# Altium project relay_matrix.PrjPCB (part 1 of 2)
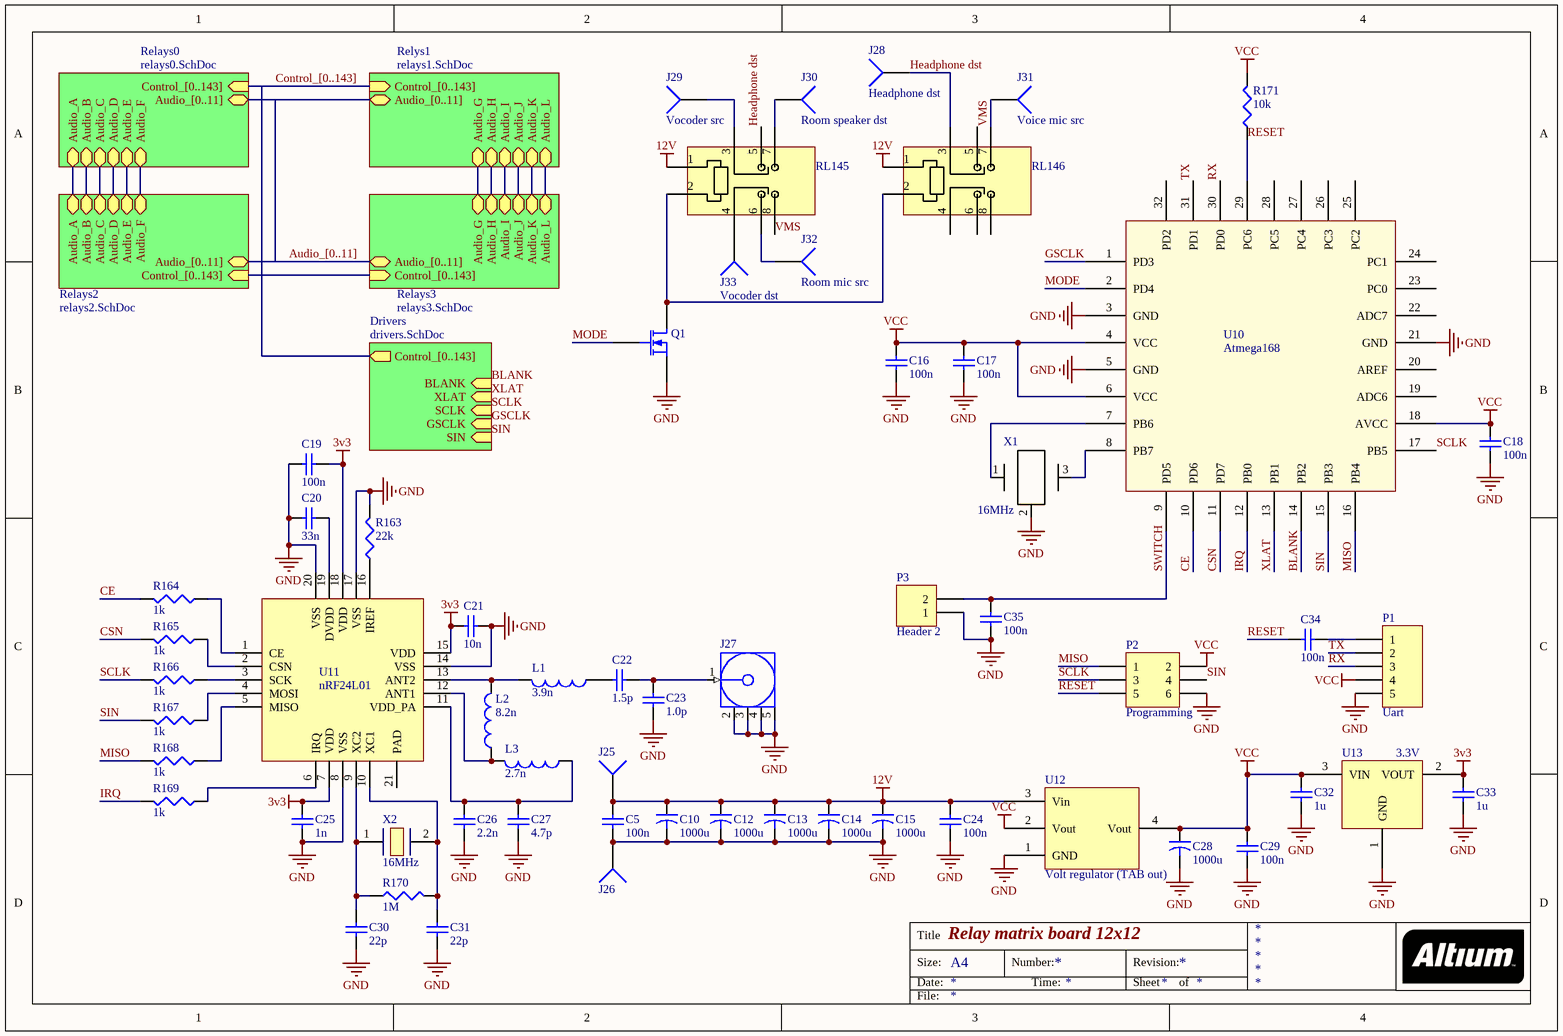
[diagram p0: relay_matrix.SchDoc]
6 sheets, 560 parts. Net scope: hierarchical (ports join the sheet entries above them; power ports are global).
Board file: relay_matrix.PcbDoc
Sheets:
  relay_matrix.SchDoc
    Relays0 = relays0.SchDoc
    Relys1 = relays1.SchDoc
    Relays2 = relays2.SchDoc
    Relays3 = relays3.SchDoc
    Drivers = drivers.SchDoc

## Sheet relay_matrix.SchDoc: Relay matrix board 12x12
size A4

### Parts
C5  value 100n  [1608[0603]]  (hidden comment: Cap Semi)
C10  value 1000u  [Cap_10x16mm]  (hidden comment: Cap2)
C12  value 1000u  [Cap_10x16mm]  (hidden comment: Cap2)
C13  value 1000u  [Cap_10x16mm]  (hidden comment: Cap2)
C14  value 1000u  [Cap_10x16mm]  (hidden comment: Cap2)
C15  value 1000u  [Cap_10x16mm]  (hidden comment: Cap2)
C16  value 100n  [1608[0603]]  (hidden comment: Cap Semi)
C17  value 100n  [1608[0603]]  (hidden comment: Cap Semi)
C18  value 100n  [1608[0603]]  (hidden comment: Cap Semi)
C19  value 100n  [1608[0603]]  (hidden comment: Cap Semi)
C20  value 33n  [1608[0603]]  (hidden comment: Cap Semi)
C21  value 10n  [1608[0603]]  (hidden comment: Cap Semi)
C22  value 1.5p  [1608[0603]]  (hidden comment: Cap Semi)
C23  value 1.0p  [1608[0603]]  (hidden comment: Cap Semi)
C24  value 100n  [1608[0603]]  (hidden comment: Cap Semi)
C25  value 1n  [1608[0603]]  (hidden comment: Cap Semi)
C26  value 2.2n  [1608[0603]]  (hidden comment: Cap Semi)
C27  value 4.7p  [1608[0603]]  (hidden comment: Cap Semi)
C28  value 1000u  [Cap_10x16mm]  (hidden comment: Cap2)
C29  value 100n  [1608[0603]]  (hidden comment: Cap Semi)
C30  value 22p  [1608[0603]]  (hidden comment: Cap Semi)
C31  value 22p  [1608[0603]]  (hidden comment: Cap Semi)
C32  value 1u  [1608[0603]]  (hidden comment: Cap Semi)
C33  value 1u  [1608[0603]]  (hidden comment: Cap Semi)
C34  value 100n  [1608[0603]]  (hidden comment: Cap Semi)
C35  value 100n  [1608[0603]]  (hidden comment: Cap Semi)
J25  Audio  [Conn_1_2x4]  (value not drawn)
J26  Audio  [Conn_1_2x4]  (value not drawn)
J27  COAX-F  [MCX5.08-H5]  (value not drawn)
J28  Headphone dst  [Conn_1_2x4]
J29  Vocoder src  [Conn_1_2x4]
J30  Room speaker dst  [Conn_1_2x4]
J31  Voice mic src  [Conn_1_2x4]
J32  Room mic src  [Conn_1_2x4]
J33  Vocoder dst  [Conn_1_2x4]
L1  value 3.9n  [1608[0603]]  (hidden comment: Inductor)
L2  value 8.2n  [1608[0603]]  (hidden comment: Inductor)
L3  value 2.7n  [1608[0603]]  (hidden comment: Inductor)
P1  Uart  [HDR1X5]
P2  Programming  [HDR2X3H]
P3  Header 2  [HDR1X2]
Q1  MOSFET-N  [SOT23_M]  (value not drawn)
R163  value 22k  [J1-0603]  (hidden comment: Res3)
R164  value 1k  [J1-0603]  (hidden comment: Res3)
R165  value 1k  [J1-0603]  (hidden comment: Res3)
R166  value 1k  [J1-0603]  (hidden comment: Res3)
R167  value 1k  [J1-0603]  (hidden comment: Res3)
R168  value 1k  [J1-0603]  (hidden comment: Res3)
R169  value 1k  [J1-0603]  (hidden comment: Res3)
R170  value 1M  [J1-0603]  (hidden comment: Res3)
R171  value 10k  [J1-0603]  (hidden comment: Res3)
RL145  Relay  [Relay_S13]  (value not drawn)
RL146  Relay  [Relay_S13]  (value not drawn)
U10  Atmega168  [TQFP-32]
U11  nRF24L01  [QFN20]
U12  Volt regulator (TAB out)  [SOT223]
U13  3.3V  [SOT23]
X1  value 16MHz  [SMD-RESONATOR]  (hidden comment: Resonator)
X2  value 16MHz  [Crystal_7A_series]  (hidden comment: Crystal)

### Sub-sheets
Drivers = drivers.SchDoc: Control_[0..143] (out), BLANK (in), XLAT (in), SCLK (in), GSCLK (in), SIN (in)
Relays0 = relays0.SchDoc: Audio_A (bidir), Audio_B (bidir), Audio_C (bidir), Audio_D (bidir), Audio_E (bidir), Audio_F (bidir), Audio_[0..11] (bidir), Control_[0..143] (in)
Relays2 = relays2.SchDoc: Audio_A (bidir), Audio_B (bidir), Audio_C (bidir), Audio_D (bidir), Audio_E (bidir), Audio_F (bidir), Audio_[0..11] (bidir), Control_[0..143] (in)
Relays3 = relays3.SchDoc: Audio_G (bidir), Audio_H (bidir), Audio_I (bidir), Audio_J (bidir), Audio_K (bidir), Audio_L (bidir), Audio_[0..11] (bidir), Control_[0..143] (in)
Relys1 = relays1.SchDoc: Audio_G (bidir), Audio_H (bidir), Audio_I (bidir), Audio_J (bidir), Audio_K (bidir), Audio_L (bidir), Audio_[0..11] (bidir), Control_[0..143] (in)

### Nets
3v3: C19.2 C21.1 C25.1 C33.1 U11.7(VDD) U11.15(VDD) U11.18(VDD) U13.2(VOUT)
12V: C5.1 C10.1 C12.1 C13.1 C14.1 C15.1 C24.1 J25.1 RL145.1 RL146.1 U12.3(Vin)
GND: C5.2 C10.2 C12.2 C13.2 C14.2 C15.2 C16.2 C17.2 C18.2 C19.1 C20.1 C21.2 C23.2 C24.2 C25.2 C26.2 C27.2 C28.2 C29.2 C30.2 C31.2 C32.2 C33.2 C35.2 J26.1 J27.2(GND) J27.3(GND) J27.4(GND) J27.5(GND) P1.5 P2.6 P3.1 Q1.3(S) R163.2 U10.3(GND) U10.5(GND) U10.21(GND) U11.8(VSS) U11.14(VSS) U11.17(VSS) U11.20(VSS) U12.1(GND) U13.1(GND) X1.2
VCC: C16.1 C17.1 C18.1 C28.1 C29.1 C32.1 P1.4 P2.2 R171.2 U10.4(VCC) U10.6(VCC) U10.18(AVCC) U12.2(Vout) U12.4(Vout) U13.3(VIN)
BLANK: U10.14(PB2) ; sheet Drivers/BLANK
CE: R164.2 U10.10(PD6)
CSN: R165.2 U10.11(PD7)
GSCLK: U10.1(PD3) ; sheet Drivers/GSCLK
Headphone dst: J28.1 RL145.5 RL146.3
IRQ: R169.2 U10.12(PB0)
MISO: P2.1 R168.2 U10.16(PB4)
MODE: Q1.2(G) U10.2(PD4)
RESET: C34.1 P2.5 R171.1 U10.29(PC6)
RX: P1.3 U10.30(PD0)
SCLK: P2.3 R166.2 U10.17(PB5) ; sheet Drivers/SCLK
SIN: P2.4 R167.2 U10.15(PB3) ; sheet Drivers/SIN
SWITCH: C35.1 P3.2 U10.9(PD5)
TX: P1.2 U10.31(PD1)
VMS: J31.1 RL145.8 RL146.7
XLAT: U10.13(PB1) ; sheet Drivers/XLAT
NetC20_2: C20.2 U11.19(DVDD)
NetC22_1: C22.1 L1.1
NetC22_2: C22.2 C23.1 J27.1(Signal)
NetC26_1: C26.1 C27.1 L3.1 U11.11(VDD_PA)
NetC30_1: C30.1 R170.1 U11.9(XC2) X2.1
NetC31_1: C31.1 R170.2 U11.10(XC1) X2.2
NetC34_2: C34.2 P1.1
NetJ1_1: sheet Relays0/Audio_A, sheet Relays2/Audio_A
NetJ2_1: sheet Relays0/Audio_B, sheet Relays2/Audio_B
NetJ3_1: sheet Relays0/Audio_C, sheet Relays2/Audio_C
NetJ4_1: sheet Relays0/Audio_D, sheet Relays2/Audio_D
NetJ5_1: sheet Relays0/Audio_E, sheet Relays2/Audio_E
NetJ6_1: sheet Relays0/Audio_F, sheet Relays2/Audio_F
NetJ13_1: sheet Relys1/Audio_G, sheet Relays3/Audio_G
NetJ14_1: sheet Relys1/Audio_H, sheet Relays3/Audio_H
NetJ15_1: sheet Relys1/Audio_I, sheet Relays3/Audio_I
NetJ16_1: sheet Relys1/Audio_J, sheet Relays3/Audio_J
NetJ17_1: sheet Relys1/Audio_K, sheet Relays3/Audio_K
NetJ18_1: sheet Relys1/Audio_L, sheet Relays3/Audio_L
NetJ29_1: J29.1 RL145.3
NetJ30_1: J30.1 RL145.7
NetJ32_1: J32.1 RL145.6
NetJ33_1: J33.1 RL145.4
NetL1_2: L1.2 L2.2 U11.13(ANT2)
NetL2_1: L2.1 L3.2 U11.12(ANT1)
NetQ1_1: Q1.1(D) RL145.2 RL146.2
NetR163_1: R163.1 U11.16(IREF)
NetR164_1: R164.1 U11.1(CE)
NetR165_1: R165.1 U11.2(CSN)
NetR166_1: R166.1 U11.3(SCK)
NetR167_1: R167.1 U11.4(MOSI)
NetR168_1: R168.1 U11.5(MISO)
NetR169_1: R169.1 U11.6(IRQ)
NetU10_7: U10.7(PB6) X1.1
NetU10_8: U10.8(PB7) X1.3

Not connected (* = marked no-connect by the designer): RL146 4 5 6 8; U10 19(ADC6) 20(AREF) 22(ADC7) 23(PC0) 24(PC1) 25(PC2) 26(PC3) 27(PC4) 28(PC5) 32(PD2); U11 21(PAD)

### Buses and harness runs
bus Audio_[0..11] = sheet Relays0/Audio_[0..11] = sheet Relays2/Audio_[0..11] = sheet Relays3/Audio_[0..11] = sheet Relys1/Audio_[0..11]
bus Control_[0..143] = sheet Drivers/Control_[0..143] = sheet Relays0/Control_[0..143] = sheet Relays2/Control_[0..143] = sheet Relays3/Control_[0..143] = sheet Relys1/Control_[0..143]

### Notes on the sheet
- Title
- Size:
- Date:
- A4
- Number:
- Time:
- Revision:
- Sheet
- of
- File:

### Library data of the parts
C5 C16-C27 C29-C35 = Cap Semi: Capacitor (Semiconductor SIM Model); Published: 8-Jun-2000; LatestRevisionDate: 29-May-2009; LatestRevisionNote: IPC-7351 Footprint Added.; PackageReference: C1206; Publisher: Altium Limited; PackageDescription: Chip Capacitor
C10 C12-C15 C28 = Cap2: Capacitor; Published: 23-Sep-2002; PackageReference: CAPR5-4X5; Publisher: Altium Limited; PackageDescription: Capacitor; 2 Leads
J25 J26 J28-J33 = Socket: LatestRevisionDate: 17-Jul-2002; LatestRevisionNote: Re-released for DXP Platform.; Publisher: Altium Limited
J27 = COAX-F: RF Coaxial PCB Connector, MCX; Thru-Hole, Right-Angle Mount Socket, Blunt Post Terminal, 50 Ohm Impedance; PCB_Layout: Complies with manufacturer's recommendation.; DrillSize: Corresponds to nominal value.; Published: 15-Jul-2004; LatestRevisionDate: 15-Jul-2004; LatestRevisionNote: Component Replaced.; DatasheetDocument: 30-May-2003; PackageDocument: 04-Jul-1999; PackageReference: 919-119J-51AX; Publisher: Altium Limited; ComponentLink1Description: Manufacturer Link; ComponentLink1URL: http://www.amphenolrf.com/
L1-L3 = Inductor: Code_IEC: 1005; Published: 8-Jun-2000; LatestRevisionDate: 29-May-2009; LatestRevisionNote: IPC-7351 Footprint Added.; PackageReference: 0402-A; Publisher: Altium Limited; PackageDescription: Chip Inductor; Code_JEITA: 0402
P1 = Header 5: Header, 5-Pin; LatestRevisionDate: 17-Jul-2002; LatestRevisionNote: Re-released for DXP Platform.; Publisher: Altium Limited
P2 = Header 3X2H: Header, 3-Pin, Dual row, Right Angle; LatestRevisionDate: 17-Jul-2002; LatestRevisionNote: Re-released for DXP Platform.; Publisher: Altium Limited
P3 = Header 2: Header, 2-Pin; LatestRevisionDate: 17-Jul-2002; LatestRevisionNote: Re-released for DXP Platform.; Publisher: Altium Limited
Q1 = MOSFET-N: N-Channel MOSFET; pin to pad: 2>3 3>2; Published: 8-Jun-2000; LatestRevisionDate: 17-Jul-2002; LatestRevisionNote: Re-released for DXP Platform.; PackageVersion: 1995/1996; PackageReference: E3; Publisher: Altium Limited; PackageDescription: TO, Flat Index; 3 In-Line, Axial Leads; Body Dia. 4.6mm; Lead Dia. 0.5 mm (max)
R163-R171 = Res3: Resistor; Published: 8-Jun-2000; LatestRevisionDate: 29-May-2009; LatestRevisionNote: IPC-7351 Footprint Added.; PackageReference: J1-0603; Publisher: Altium Limited; PackageDescription: Chip Resistor
RL145 RL146 = Relay_S13: Miniature power relay; Part number: S13-12V-2C
U11 = nRF24L01: Single Chip 2.4GHz Transciever; Part number: *
U12 = Volt regulator (TAB out): AP1117; Part number: 1825292
U13 = Voltage_regulator_3pin: Fixed voltage regulator; Part number: 2363085
X2 = Crystal: Part Number: *

## Sheet relays0.SchDoc
size A4
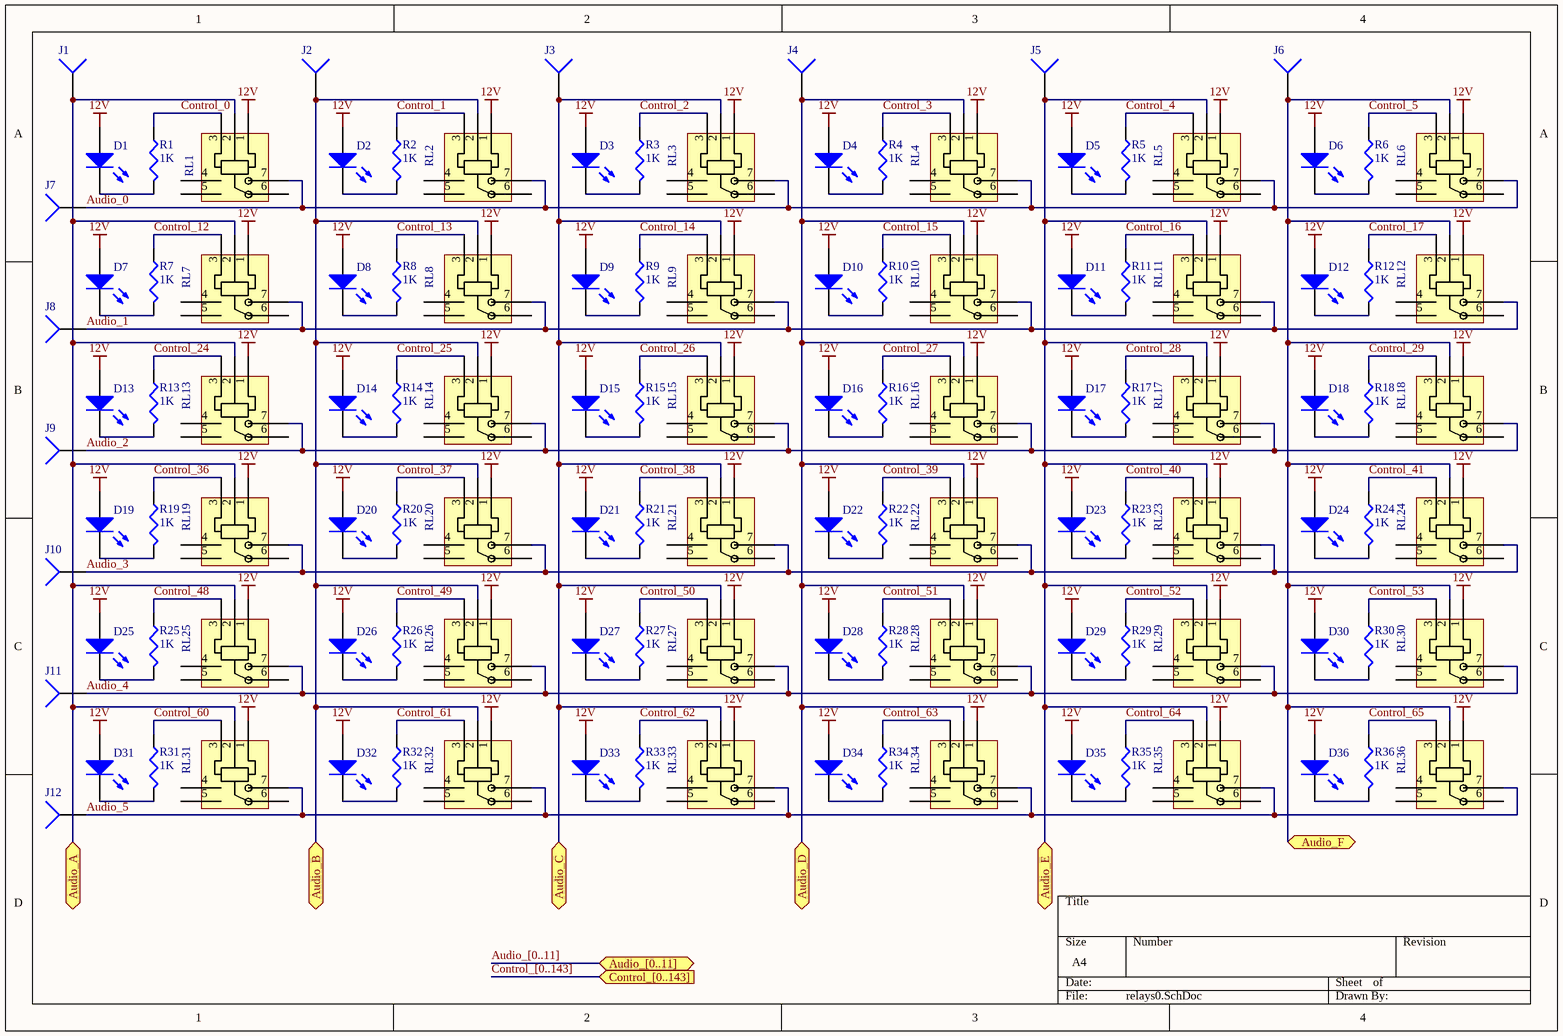
[diagram p1: relays0.SchDoc]

### Parts
D1  LED0  [LED_round_5mm]  (value not drawn)
D2  LED0  [LED_round_5mm]  (value not drawn)
D3  LED0  [LED_round_5mm]  (value not drawn)
D4  LED0  [LED_round_5mm]  (value not drawn)
D5  LED0  [LED_round_5mm]  (value not drawn)
D6  LED0  [LED_round_5mm]  (value not drawn)
D7  LED0  [LED_round_5mm]  (value not drawn)
D8  LED0  [LED_round_5mm]  (value not drawn)
D9  LED0  [LED_round_5mm]  (value not drawn)
D10  LED0  [LED_round_5mm]  (value not drawn)
D11  LED0  [LED_round_5mm]  (value not drawn)
D12  LED0  [LED_round_5mm]  (value not drawn)
D13  LED0  [LED_round_5mm]  (value not drawn)
D14  LED0  [LED_round_5mm]  (value not drawn)
D15  LED0  [LED_round_5mm]  (value not drawn)
D16  LED0  [LED_round_5mm]  (value not drawn)
D17  LED0  [LED_round_5mm]  (value not drawn)
D18  LED0  [LED_round_5mm]  (value not drawn)
D19  LED0  [LED_round_5mm]  (value not drawn)
D20  LED0  [LED_round_5mm]  (value not drawn)
D21  LED0  [LED_round_5mm]  (value not drawn)
D22  LED0  [LED_round_5mm]  (value not drawn)
D23  LED0  [LED_round_5mm]  (value not drawn)
D24  LED0  [LED_round_5mm]  (value not drawn)
D25  LED0  [LED_round_5mm]  (value not drawn)
D26  LED0  [LED_round_5mm]  (value not drawn)
D27  LED0  [LED_round_5mm]  (value not drawn)
D28  LED0  [LED_round_5mm]  (value not drawn)
D29  LED0  [LED_round_5mm]  (value not drawn)
D30  LED0  [LED_round_5mm]  (value not drawn)
D31  LED0  [LED_round_5mm]  (value not drawn)
D32  LED0  [LED_round_5mm]  (value not drawn)
D33  LED0  [LED_round_5mm]  (value not drawn)
D34  LED0  [LED_round_5mm]  (value not drawn)
D35  LED0  [LED_round_5mm]  (value not drawn)
D36  LED0  [LED_round_5mm]  (value not drawn)
J1  Audio  [Conn_1_2x4]  (value not drawn)
J2  Audio  [Conn_1_2x4]  (value not drawn)
J3  Audio  [Conn_1_2x4]  (value not drawn)
J4  Audio  [Conn_1_2x4]  (value not drawn)
J5  Audio  [Conn_1_2x4]  (value not drawn)
J6  Audio  [Conn_1_2x4]  (value not drawn)
J7  Audio  [Conn_1_2x4]  (value not drawn)
J8  Audio  [Conn_1_2x4]  (value not drawn)
J9  Audio  [Conn_1_2x4]  (value not drawn)
J10  Audio  [Conn_1_2x4]  (value not drawn)
J11  Audio  [Conn_1_2x4]  (value not drawn)
J12  Audio  [Conn_1_2x4]  (value not drawn)
R1  value 1K  [J1-0603]  (hidden comment: Res3)
R2  value 1K  [J1-0603]  (hidden comment: Res3)
R3  value 1K  [J1-0603]  (hidden comment: Res3)
R4  value 1K  [J1-0603]  (hidden comment: Res3)
R5  value 1K  [J1-0603]  (hidden comment: Res3)
R6  value 1K  [J1-0603]  (hidden comment: Res3)
R7  value 1K  [J1-0603]  (hidden comment: Res3)
R8  value 1K  [J1-0603]  (hidden comment: Res3)
R9  value 1K  [J1-0603]  (hidden comment: Res3)
R10  value 1K  [J1-0603]  (hidden comment: Res3)
R11  value 1K  [J1-0603]  (hidden comment: Res3)
R12  value 1K  [J1-0603]  (hidden comment: Res3)
R13  value 1K  [J1-0603]  (hidden comment: Res3)
R14  value 1K  [J1-0603]  (hidden comment: Res3)
R15  value 1K  [J1-0603]  (hidden comment: Res3)
R16  value 1K  [J1-0603]  (hidden comment: Res3)
R17  value 1K  [J1-0603]  (hidden comment: Res3)
R18  value 1K  [J1-0603]  (hidden comment: Res3)
R19  value 1K  [J1-0603]  (hidden comment: Res3)
R20  value 1K  [J1-0603]  (hidden comment: Res3)
R21  value 1K  [J1-0603]  (hidden comment: Res3)
R22  value 1K  [J1-0603]  (hidden comment: Res3)
R23  value 1K  [J1-0603]  (hidden comment: Res3)
R24  value 1K  [J1-0603]  (hidden comment: Res3)
R25  value 1K  [J1-0603]  (hidden comment: Res3)
R26  value 1K  [J1-0603]  (hidden comment: Res3)
R27  value 1K  [J1-0603]  (hidden comment: Res3)
R28  value 1K  [J1-0603]  (hidden comment: Res3)
R29  value 1K  [J1-0603]  (hidden comment: Res3)
R30  value 1K  [J1-0603]  (hidden comment: Res3)
R31  value 1K  [J1-0603]  (hidden comment: Res3)
R32  value 1K  [J1-0603]  (hidden comment: Res3)
R33  value 1K  [J1-0603]  (hidden comment: Res3)
R34  value 1K  [J1-0603]  (hidden comment: Res3)
R35  value 1K  [J1-0603]  (hidden comment: Res3)
R36  value 1K  [J1-0603]  (hidden comment: Res3)
RL1  Relay  [Relay_FRA3]  (value not drawn)
RL2  Relay  [Relay_FRA3]  (value not drawn)
RL3  Relay  [Relay_FRA3]  (value not drawn)
RL4  Relay  [Relay_FRA3]  (value not drawn)
RL5  Relay  [Relay_FRA3]  (value not drawn)
RL6  Relay  [Relay_FRA3]  (value not drawn)
RL7  Relay  [Relay_FRA3]  (value not drawn)
RL8  Relay  [Relay_FRA3]  (value not drawn)
RL9  Relay  [Relay_FRA3]  (value not drawn)
RL10  Relay  [Relay_FRA3]  (value not drawn)
RL11  Relay  [Relay_FRA3]  (value not drawn)
RL12  Relay  [Relay_FRA3]  (value not drawn)
RL13  Relay  [Relay_FRA3]  (value not drawn)
RL14  Relay  [Relay_FRA3]  (value not drawn)
RL15  Relay  [Relay_FRA3]  (value not drawn)
RL16  Relay  [Relay_FRA3]  (value not drawn)
RL17  Relay  [Relay_FRA3]  (value not drawn)
RL18  Relay  [Relay_FRA3]  (value not drawn)
RL19  Relay  [Relay_FRA3]  (value not drawn)
RL20  Relay  [Relay_FRA3]  (value not drawn)
RL21  Relay  [Relay_FRA3]  (value not drawn)
RL22  Relay  [Relay_FRA3]  (value not drawn)
RL23  Relay  [Relay_FRA3]  (value not drawn)
RL24  Relay  [Relay_FRA3]  (value not drawn)
RL25  Relay  [Relay_FRA3]  (value not drawn)
RL26  Relay  [Relay_FRA3]  (value not drawn)
RL27  Relay  [Relay_FRA3]  (value not drawn)
RL28  Relay  [Relay_FRA3]  (value not drawn)
RL29  Relay  [Relay_FRA3]  (value not drawn)
RL30  Relay  [Relay_FRA3]  (value not drawn)
RL31  Relay  [Relay_FRA3]  (value not drawn)
RL32  Relay  [Relay_FRA3]  (value not drawn)
RL33  Relay  [Relay_FRA3]  (value not drawn)
RL34  Relay  [Relay_FRA3]  (value not drawn)
RL35  Relay  [Relay_FRA3]  (value not drawn)
RL36  Relay  [Relay_FRA3]  (value not drawn)

### Ports
Audio_[0..11] (bidir), Audio_A (bidir), Audio_B (bidir), Audio_C (bidir), Audio_D (bidir), Audio_E (bidir), Audio_F (bidir), Control_[0..143] (in)

### Nets
12V: D1.1(A) D2.1(A) D3.1(A) D4.1(A) D5.1(A) D6.1(A) D7.1(A) D8.1(A) D9.1(A) D10.1(A) D11.1(A) D12.1(A) D13.1(A) D14.1(A) D15.1(A) D16.1(A) D17.1(A) D18.1(A) D19.1(A) D20.1(A) D21.1(A) D22.1(A) D23.1(A) D24.1(A) D25.1(A) D26.1(A) D27.1(A) D28.1(A) D29.1(A) D30.1(A) D31.1(A) D32.1(A) D33.1(A) D34.1(A) D35.1(A) D36.1(A) RL1.1 RL2.1 RL3.1 RL4.1 RL5.1 RL6.1 RL7.1 RL8.1 RL9.1 RL10.1 RL11.1 RL12.1 RL13.1 RL14.1 RL15.1 RL16.1 RL17.1 RL18.1 RL19.1 RL20.1 RL21.1 RL22.1 RL23.1 RL24.1 RL25.1 RL26.1 RL27.1 RL28.1 RL29.1 RL30.1 RL31.1 RL32.1 RL33.1 RL34.1 RL35.1 RL36.1
Audio_0: J7.1 RL1.7 RL2.7 RL3.7 RL4.7 RL5.7 RL6.7
Audio_1: J8.1 RL7.7 RL8.7 RL9.7 RL10.7 RL11.7 RL12.7
Audio_2: J9.1 RL13.7 RL14.7 RL15.7 RL16.7 RL17.7 RL18.7
Audio_3: J10.1 RL19.7 RL20.7 RL21.7 RL22.7 RL23.7 RL24.7
Audio_4: J11.1 RL25.7 RL26.7 RL27.7 RL28.7 RL29.7 RL30.7
Audio_5: J12.1 RL31.7 RL32.7 RL33.7 RL34.7 RL35.7 RL36.7
Control_0: R1.1 RL1.3
Control_1: R2.1 RL2.3
Control_2: R3.1 RL3.3
Control_3: R4.1 RL4.3
Control_4: R5.1 RL5.3
Control_5: R6.1 RL6.3
Control_12: R7.1 RL7.3
Control_13: R8.1 RL8.3
Control_14: R9.1 RL9.3
Control_15: R10.1 RL10.3
Control_16: R11.1 RL11.3
Control_17: R12.1 RL12.3
Control_24: R13.1 RL13.3
Control_25: R14.1 RL14.3
Control_26: R15.1 RL15.3
Control_27: R16.1 RL16.3
Control_28: R17.1 RL17.3
Control_29: R18.1 RL18.3
Control_36: R19.1 RL19.3
Control_37: R20.1 RL20.3
Control_38: R21.1 RL21.3
Control_39: R22.1 RL22.3
Control_40: R23.1 RL23.3
Control_41: R24.1 RL24.3
Control_48: R25.1 RL25.3
Control_49: R26.1 RL26.3
Control_50: R27.1 RL27.3
Control_51: R28.1 RL28.3
Control_52: R29.1 RL29.3
Control_53: R30.1 RL30.3
Control_60: R31.1 RL31.3
Control_61: R32.1 RL32.3
Control_62: R33.1 RL33.3
Control_63: R34.1 RL34.3
Control_64: R35.1 RL35.3
Control_65: R36.1 RL36.3
NetD1_2: D1.2(K) R1.2
NetD2_2: D2.2(K) R2.2
NetD3_2: D3.2(K) R3.2
NetD4_2: D4.2(K) R4.2
NetD5_2: D5.2(K) R5.2
NetD6_2: D6.2(K) R6.2
NetD7_2: D7.2(K) R7.2
NetD8_2: D8.2(K) R8.2
NetD9_2: D9.2(K) R9.2
NetD10_2: D10.2(K) R10.2
NetD11_2: D11.2(K) R11.2
NetD12_2: D12.2(K) R12.2
NetD13_2: D13.2(K) R13.2
NetD14_2: D14.2(K) R14.2
NetD15_2: D15.2(K) R15.2
NetD16_2: D16.2(K) R16.2
NetD17_2: D17.2(K) R17.2
NetD18_2: D18.2(K) R18.2
NetD19_2: D19.2(K) R19.2
NetD20_2: D20.2(K) R20.2
NetD21_2: D21.2(K) R21.2
NetD22_2: D22.2(K) R22.2
NetD23_2: D23.2(K) R23.2
NetD24_2: D24.2(K) R24.2
NetD25_2: D25.2(K) R25.2
NetD26_2: D26.2(K) R26.2
NetD27_2: D27.2(K) R27.2
NetD28_2: D28.2(K) R28.2
NetD29_2: D29.2(K) R29.2
NetD30_2: D30.2(K) R30.2
NetD31_2: D31.2(K) R31.2
NetD32_2: D32.2(K) R32.2
NetD33_2: D33.2(K) R33.2
NetD34_2: D34.2(K) R34.2
NetD35_2: D35.2(K) R35.2
NetD36_2: D36.2(K) R36.2
NetJ1_1: J1.1 RL1.2 RL7.2 RL13.2 RL19.2 RL25.2 RL31.2 ; port Audio_A
NetJ2_1: J2.1 RL2.2 RL8.2 RL14.2 RL20.2 RL26.2 RL32.2 ; port Audio_B
NetJ3_1: J3.1 RL3.2 RL9.2 RL15.2 RL21.2 RL27.2 RL33.2 ; port Audio_C
NetJ4_1: J4.1 RL4.2 RL10.2 RL16.2 RL22.2 RL28.2 RL34.2 ; port Audio_D
NetJ5_1: J5.1 RL5.2 RL11.2 RL17.2 RL23.2 RL29.2 RL35.2 ; port Audio_E
NetJ6_1: J6.1 RL6.2 RL12.2 RL18.2 RL24.2 RL30.2 RL36.2 ; port Audio_F

Not connected (* = marked no-connect by the designer): RL1 4 5 6; RL2 4 5 6; RL3 4 5 6; RL4 4 5 6; RL5 4 5 6; RL6 4 5 6; RL7 4 5 6; RL8 4 5 6; RL9 4 5 6; RL10 4 5 6; RL11 4 5 6; RL12 4 5 6; RL13 4 5 6; RL14 4 5 6; RL15 4 5 6; RL16 4 5 6; RL17 4 5 6; RL18 4 5 6; RL19 4 5 6; RL20 4 5 6; RL21 4 5 6; RL22 4 5 6; RL23 4 5 6; RL24 4 5 6; RL25 4 5 6; RL26 4 5 6; RL27 4 5 6; RL28 4 5 6; RL29 4 5 6; RL30 4 5 6; RL31 4 5 6; RL32 4 5 6; RL33 4 5 6; RL34 4 5 6; RL35 4 5 6; RL36 4 5 6

### Buses and harness runs
bus Audio_[0..11] = port Audio_[0..11]
bus Control_[0..143] = port Control_[0..143]

### Library data of the parts
D1-D36 = LED0: Typical INFRARED GaAs LED; Published: 8-Jun-2000; LatestRevisionDate: 08-Jul-2005; LatestRevisionNote: Mech Layer 1 removed.; PackageReference: LED-0; Publisher: Altium Limited; PackageDescription: LED; 2 Leads
J1-J12 = Socket: LatestRevisionDate: 17-Jul-2002; LatestRevisionNote: Re-released for DXP Platform.; Publisher: Altium Limited
R1-R36 = Res3: Resistor; Published: 8-Jun-2000; LatestRevisionDate: 29-May-2009; LatestRevisionNote: IPC-7351 Footprint Added.; PackageReference: J1-0603; Publisher: Altium Limited; PackageDescription: Chip Resistor
RL1-RL36 = Relay_FRA3: Miniature power relay; Part number: FRA3C-DC12

## Sheet relays1.SchDoc
size A4
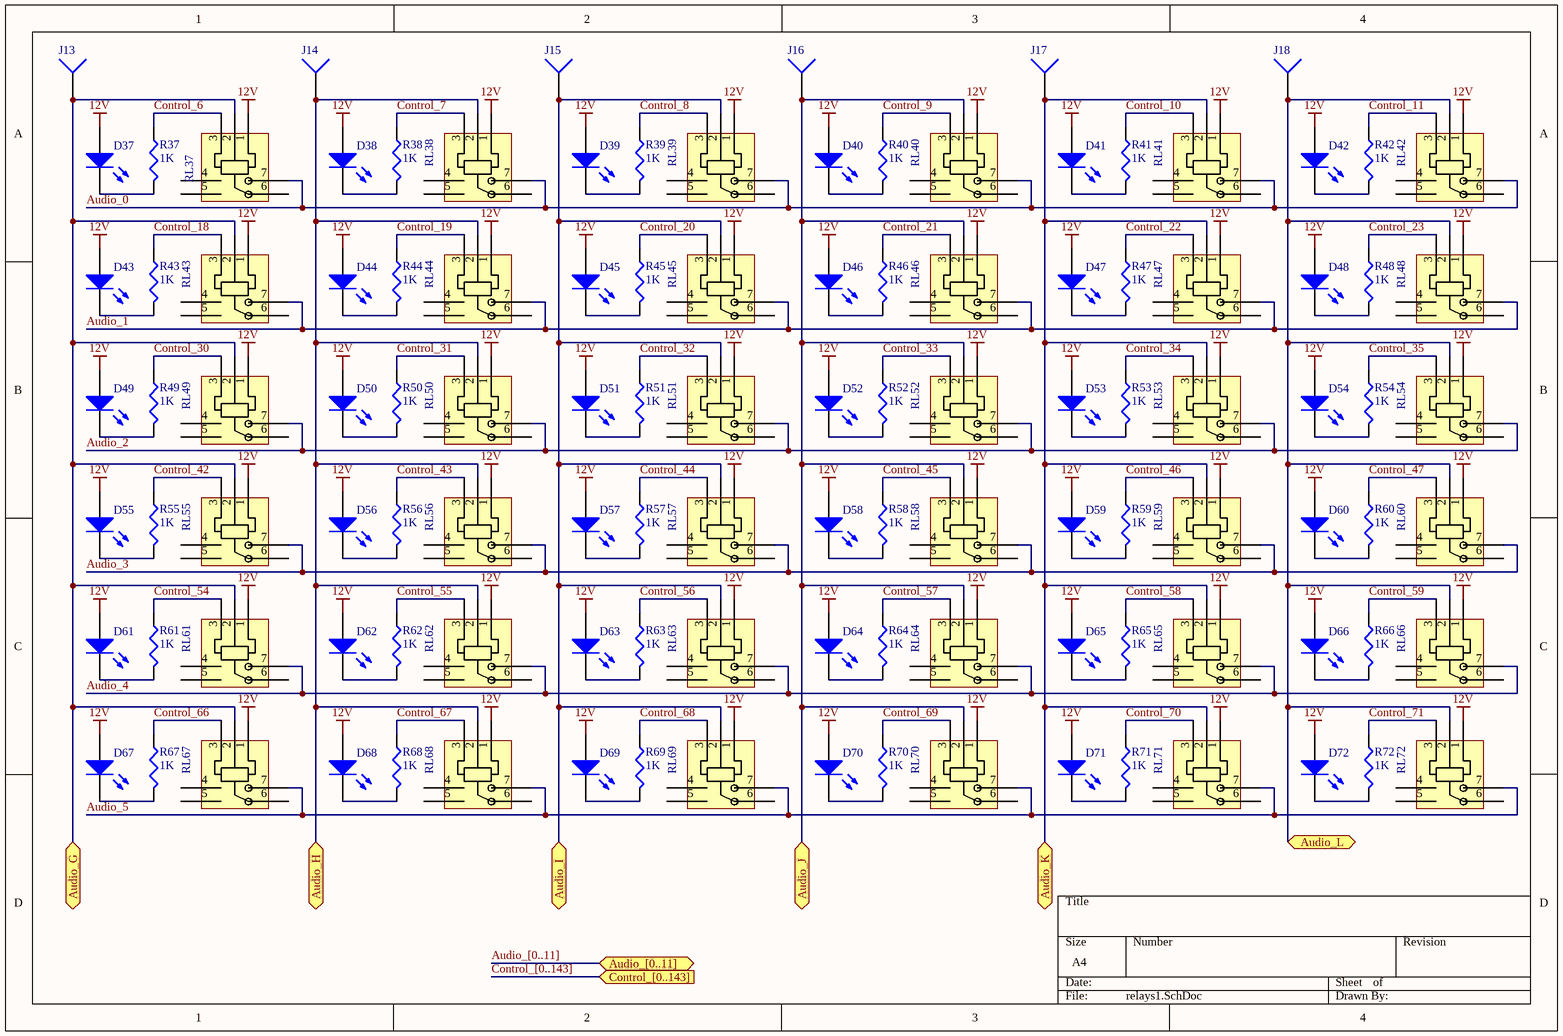
[diagram p2: relays1.SchDoc]

### Parts
D37  LED0  [LED_round_5mm]  (value not drawn)
D38  LED0  [LED_round_5mm]  (value not drawn)
D39  LED0  [LED_round_5mm]  (value not drawn)
D40  LED0  [LED_round_5mm]  (value not drawn)
D41  LED0  [LED_round_5mm]  (value not drawn)
D42  LED0  [LED_round_5mm]  (value not drawn)
D43  LED0  [LED_round_5mm]  (value not drawn)
D44  LED0  [LED_round_5mm]  (value not drawn)
D45  LED0  [LED_round_5mm]  (value not drawn)
D46  LED0  [LED_round_5mm]  (value not drawn)
D47  LED0  [LED_round_5mm]  (value not drawn)
D48  LED0  [LED_round_5mm]  (value not drawn)
D49  LED0  [LED_round_5mm]  (value not drawn)
D50  LED0  [LED_round_5mm]  (value not drawn)
D51  LED0  [LED_round_5mm]  (value not drawn)
D52  LED0  [LED_round_5mm]  (value not drawn)
D53  LED0  [LED_round_5mm]  (value not drawn)
D54  LED0  [LED_round_5mm]  (value not drawn)
D55  LED0  [LED_round_5mm]  (value not drawn)
D56  LED0  [LED_round_5mm]  (value not drawn)
D57  LED0  [LED_round_5mm]  (value not drawn)
D58  LED0  [LED_round_5mm]  (value not drawn)
D59  LED0  [LED_round_5mm]  (value not drawn)
D60  LED0  [LED_round_5mm]  (value not drawn)
D61  LED0  [LED_round_5mm]  (value not drawn)
D62  LED0  [LED_round_5mm]  (value not drawn)
D63  LED0  [LED_round_5mm]  (value not drawn)
D64  LED0  [LED_round_5mm]  (value not drawn)
D65  LED0  [LED_round_5mm]  (value not drawn)
D66  LED0  [LED_round_5mm]  (value not drawn)
D67  LED0  [LED_round_5mm]  (value not drawn)
D68  LED0  [LED_round_5mm]  (value not drawn)
D69  LED0  [LED_round_5mm]  (value not drawn)
D70  LED0  [LED_round_5mm]  (value not drawn)
D71  LED0  [LED_round_5mm]  (value not drawn)
D72  LED0  [LED_round_5mm]  (value not drawn)
J13  Audio  [Conn_1_2x4]  (value not drawn)
J14  Audio  [Conn_1_2x4]  (value not drawn)
J15  Audio  [Conn_1_2x4]  (value not drawn)
J16  Audio  [Conn_1_2x4]  (value not drawn)
J17  Audio  [Conn_1_2x4]  (value not drawn)
J18  Audio  [Conn_1_2x4]  (value not drawn)
R37  value 1K  [J1-0603]  (hidden comment: Res3)
R38  value 1K  [J1-0603]  (hidden comment: Res3)
R39  value 1K  [J1-0603]  (hidden comment: Res3)
R40  value 1K  [J1-0603]  (hidden comment: Res3)
R41  value 1K  [J1-0603]  (hidden comment: Res3)
R42  value 1K  [J1-0603]  (hidden comment: Res3)
R43  value 1K  [J1-0603]  (hidden comment: Res3)
R44  value 1K  [J1-0603]  (hidden comment: Res3)
R45  value 1K  [J1-0603]  (hidden comment: Res3)
R46  value 1K  [J1-0603]  (hidden comment: Res3)
R47  value 1K  [J1-0603]  (hidden comment: Res3)
R48  value 1K  [J1-0603]  (hidden comment: Res3)
R49  value 1K  [J1-0603]  (hidden comment: Res3)
R50  value 1K  [J1-0603]  (hidden comment: Res3)
R51  value 1K  [J1-0603]  (hidden comment: Res3)
R52  value 1K  [J1-0603]  (hidden comment: Res3)
R53  value 1K  [J1-0603]  (hidden comment: Res3)
R54  value 1K  [J1-0603]  (hidden comment: Res3)
R55  value 1K  [J1-0603]  (hidden comment: Res3)
R56  value 1K  [J1-0603]  (hidden comment: Res3)
R57  value 1K  [J1-0603]  (hidden comment: Res3)
R58  value 1K  [J1-0603]  (hidden comment: Res3)
R59  value 1K  [J1-0603]  (hidden comment: Res3)
R60  value 1K  [J1-0603]  (hidden comment: Res3)
R61  value 1K  [J1-0603]  (hidden comment: Res3)
R62  value 1K  [J1-0603]  (hidden comment: Res3)
R63  value 1K  [J1-0603]  (hidden comment: Res3)
R64  value 1K  [J1-0603]  (hidden comment: Res3)
R65  value 1K  [J1-0603]  (hidden comment: Res3)
R66  value 1K  [J1-0603]  (hidden comment: Res3)
R67  value 1K  [J1-0603]  (hidden comment: Res3)
R68  value 1K  [J1-0603]  (hidden comment: Res3)
R69  value 1K  [J1-0603]  (hidden comment: Res3)
R70  value 1K  [J1-0603]  (hidden comment: Res3)
R71  value 1K  [J1-0603]  (hidden comment: Res3)
R72  value 1K  [J1-0603]  (hidden comment: Res3)
RL37  Relay  [Relay_FRA3]  (value not drawn)
RL38  Relay  [Relay_FRA3]  (value not drawn)
RL39  Relay  [Relay_FRA3]  (value not drawn)
RL40  Relay  [Relay_FRA3]  (value not drawn)
RL41  Relay  [Relay_FRA3]  (value not drawn)
RL42  Relay  [Relay_FRA3]  (value not drawn)
RL43  Relay  [Relay_FRA3]  (value not drawn)
RL44  Relay  [Relay_FRA3]  (value not drawn)
RL45  Relay  [Relay_FRA3]  (value not drawn)
RL46  Relay  [Relay_FRA3]  (value not drawn)
RL47  Relay  [Relay_FRA3]  (value not drawn)
RL48  Relay  [Relay_FRA3]  (value not drawn)
RL49  Relay  [Relay_FRA3]  (value not drawn)
RL50  Relay  [Relay_FRA3]  (value not drawn)
RL51  Relay  [Relay_FRA3]  (value not drawn)
RL52  Relay  [Relay_FRA3]  (value not drawn)
RL53  Relay  [Relay_FRA3]  (value not drawn)
RL54  Relay  [Relay_FRA3]  (value not drawn)
RL55  Relay  [Relay_FRA3]  (value not drawn)
RL56  Relay  [Relay_FRA3]  (value not drawn)
RL57  Relay  [Relay_FRA3]  (value not drawn)
RL58  Relay  [Relay_FRA3]  (value not drawn)
RL59  Relay  [Relay_FRA3]  (value not drawn)
RL60  Relay  [Relay_FRA3]  (value not drawn)
RL61  Relay  [Relay_FRA3]  (value not drawn)
RL62  Relay  [Relay_FRA3]  (value not drawn)
RL63  Relay  [Relay_FRA3]  (value not drawn)
RL64  Relay  [Relay_FRA3]  (value not drawn)
RL65  Relay  [Relay_FRA3]  (value not drawn)
RL66  Relay  [Relay_FRA3]  (value not drawn)
RL67  Relay  [Relay_FRA3]  (value not drawn)
RL68  Relay  [Relay_FRA3]  (value not drawn)
RL69  Relay  [Relay_FRA3]  (value not drawn)
RL70  Relay  [Relay_FRA3]  (value not drawn)
RL71  Relay  [Relay_FRA3]  (value not drawn)
RL72  Relay  [Relay_FRA3]  (value not drawn)

### Ports
Audio_[0..11] (bidir), Audio_G (bidir), Audio_H (bidir), Audio_I (bidir), Audio_J (bidir), Audio_K (bidir), Audio_L (bidir), Control_[0..143] (in)

### Nets
12V: D37.1(A) D38.1(A) D39.1(A) D40.1(A) D41.1(A) D42.1(A) D43.1(A) D44.1(A) D45.1(A) D46.1(A) D47.1(A) D48.1(A) D49.1(A) D50.1(A) D51.1(A) D52.1(A) D53.1(A) D54.1(A) D55.1(A) D56.1(A) D57.1(A) D58.1(A) D59.1(A) D60.1(A) D61.1(A) D62.1(A) D63.1(A) D64.1(A) D65.1(A) D66.1(A) D67.1(A) D68.1(A) D69.1(A) D70.1(A) D71.1(A) D72.1(A) RL37.1 RL38.1 RL39.1 RL40.1 RL41.1 RL42.1 RL43.1 RL44.1 RL45.1 RL46.1 RL47.1 RL48.1 RL49.1 RL50.1 RL51.1 RL52.1 RL53.1 RL54.1 RL55.1 RL56.1 RL57.1 RL58.1 RL59.1 RL60.1 RL61.1 RL62.1 RL63.1 RL64.1 RL65.1 RL66.1 RL67.1 RL68.1 RL69.1 RL70.1 RL71.1 RL72.1
Audio_0: RL37.7 RL38.7 RL39.7 RL40.7 RL41.7 RL42.7
Audio_1: RL43.7 RL44.7 RL45.7 RL46.7 RL47.7 RL48.7
Audio_2: RL49.7 RL50.7 RL51.7 RL52.7 RL53.7 RL54.7
Audio_3: RL55.7 RL56.7 RL57.7 RL58.7 RL59.7 RL60.7
Audio_4: RL61.7 RL62.7 RL63.7 RL64.7 RL65.7 RL66.7
Audio_5: RL67.7 RL68.7 RL69.7 RL70.7 RL71.7 RL72.7
Control_6: R37.1 RL37.3
Control_7: R38.1 RL38.3
Control_8: R39.1 RL39.3
Control_9: R40.1 RL40.3
Control_10: R41.1 RL41.3
Control_11: R42.1 RL42.3
Control_18: R43.1 RL43.3
Control_19: R44.1 RL44.3
Control_20: R45.1 RL45.3
Control_21: R46.1 RL46.3
Control_22: R47.1 RL47.3
Control_23: R48.1 RL48.3
Control_30: R49.1 RL49.3
Control_31: R50.1 RL50.3
Control_32: R51.1 RL51.3
Control_33: R52.1 RL52.3
Control_34: R53.1 RL53.3
Control_35: R54.1 RL54.3
Control_42: R55.1 RL55.3
Control_43: R56.1 RL56.3
Control_44: R57.1 RL57.3
Control_45: R58.1 RL58.3
Control_46: R59.1 RL59.3
Control_47: R60.1 RL60.3
Control_54: R61.1 RL61.3
Control_55: R62.1 RL62.3
Control_56: R63.1 RL63.3
Control_57: R64.1 RL64.3
Control_58: R65.1 RL65.3
Control_59: R66.1 RL66.3
Control_66: R67.1 RL67.3
Control_67: R68.1 RL68.3
Control_68: R69.1 RL69.3
Control_69: R70.1 RL70.3
Control_70: R71.1 RL71.3
Control_71: R72.1 RL72.3
NetD37_2: D37.2(K) R37.2
NetD38_2: D38.2(K) R38.2
NetD39_2: D39.2(K) R39.2
NetD40_2: D40.2(K) R40.2
NetD41_2: D41.2(K) R41.2
NetD42_2: D42.2(K) R42.2
NetD43_2: D43.2(K) R43.2
NetD44_2: D44.2(K) R44.2
NetD45_2: D45.2(K) R45.2
NetD46_2: D46.2(K) R46.2
NetD47_2: D47.2(K) R47.2
NetD48_2: D48.2(K) R48.2
NetD49_2: D49.2(K) R49.2
NetD50_2: D50.2(K) R50.2
NetD51_2: D51.2(K) R51.2
NetD52_2: D52.2(K) R52.2
NetD53_2: D53.2(K) R53.2
NetD54_2: D54.2(K) R54.2
NetD55_2: D55.2(K) R55.2
NetD56_2: D56.2(K) R56.2
NetD57_2: D57.2(K) R57.2
NetD58_2: D58.2(K) R58.2
NetD59_2: D59.2(K) R59.2
NetD60_2: D60.2(K) R60.2
NetD61_2: D61.2(K) R61.2
NetD62_2: D62.2(K) R62.2
NetD63_2: D63.2(K) R63.2
NetD64_2: D64.2(K) R64.2
NetD65_2: D65.2(K) R65.2
NetD66_2: D66.2(K) R66.2
NetD67_2: D67.2(K) R67.2
NetD68_2: D68.2(K) R68.2
NetD69_2: D69.2(K) R69.2
NetD70_2: D70.2(K) R70.2
NetD71_2: D71.2(K) R71.2
NetD72_2: D72.2(K) R72.2
NetJ13_1: J13.1 RL37.2 RL43.2 RL49.2 RL55.2 RL61.2 RL67.2 ; port Audio_G
NetJ14_1: J14.1 RL38.2 RL44.2 RL50.2 RL56.2 RL62.2 RL68.2 ; port Audio_H
NetJ15_1: J15.1 RL39.2 RL45.2 RL51.2 RL57.2 RL63.2 RL69.2 ; port Audio_I
NetJ16_1: J16.1 RL40.2 RL46.2 RL52.2 RL58.2 RL64.2 RL70.2 ; port Audio_J
NetJ17_1: J17.1 RL41.2 RL47.2 RL53.2 RL59.2 RL65.2 RL71.2 ; port Audio_K
NetJ18_1: J18.1 RL42.2 RL48.2 RL54.2 RL60.2 RL66.2 RL72.2 ; port Audio_L

Not connected (* = marked no-connect by the designer): RL37 4 5 6; RL38 4 5 6; RL39 4 5 6; RL40 4 5 6; RL41 4 5 6; RL42 4 5 6; RL43 4 5 6; RL44 4 5 6; RL45 4 5 6; RL46 4 5 6; RL47 4 5 6; RL48 4 5 6; RL49 4 5 6; RL50 4 5 6; RL51 4 5 6; RL52 4 5 6; RL53 4 5 6; RL54 4 5 6; RL55 4 5 6; RL56 4 5 6; RL57 4 5 6; RL58 4 5 6; RL59 4 5 6; RL60 4 5 6; RL61 4 5 6; RL62 4 5 6; RL63 4 5 6; RL64 4 5 6; RL65 4 5 6; RL66 4 5 6; RL67 4 5 6; RL68 4 5 6; RL69 4 5 6; RL70 4 5 6; RL71 4 5 6; RL72 4 5 6

### Buses and harness runs
bus Audio_[0..11] = port Audio_[0..11]
bus Control_[0..143] = port Control_[0..143]

### Library data of the parts
D37-D72 = LED0: Typical INFRARED GaAs LED; Published: 8-Jun-2000; LatestRevisionDate: 08-Jul-2005; LatestRevisionNote: Mech Layer 1 removed.; PackageReference: LED-0; Publisher: Altium Limited; PackageDescription: LED; 2 Leads
J13-J18 = Socket: LatestRevisionDate: 17-Jul-2002; LatestRevisionNote: Re-released for DXP Platform.; Publisher: Altium Limited
R37-R72 = Res3: Resistor; Published: 8-Jun-2000; LatestRevisionDate: 29-May-2009; LatestRevisionNote: IPC-7351 Footprint Added.; PackageReference: J1-0603; Publisher: Altium Limited; PackageDescription: Chip Resistor
RL37-RL72 = Relay_FRA3: as RL1 on sheet relays0

## Sheet relays2.SchDoc
size A4
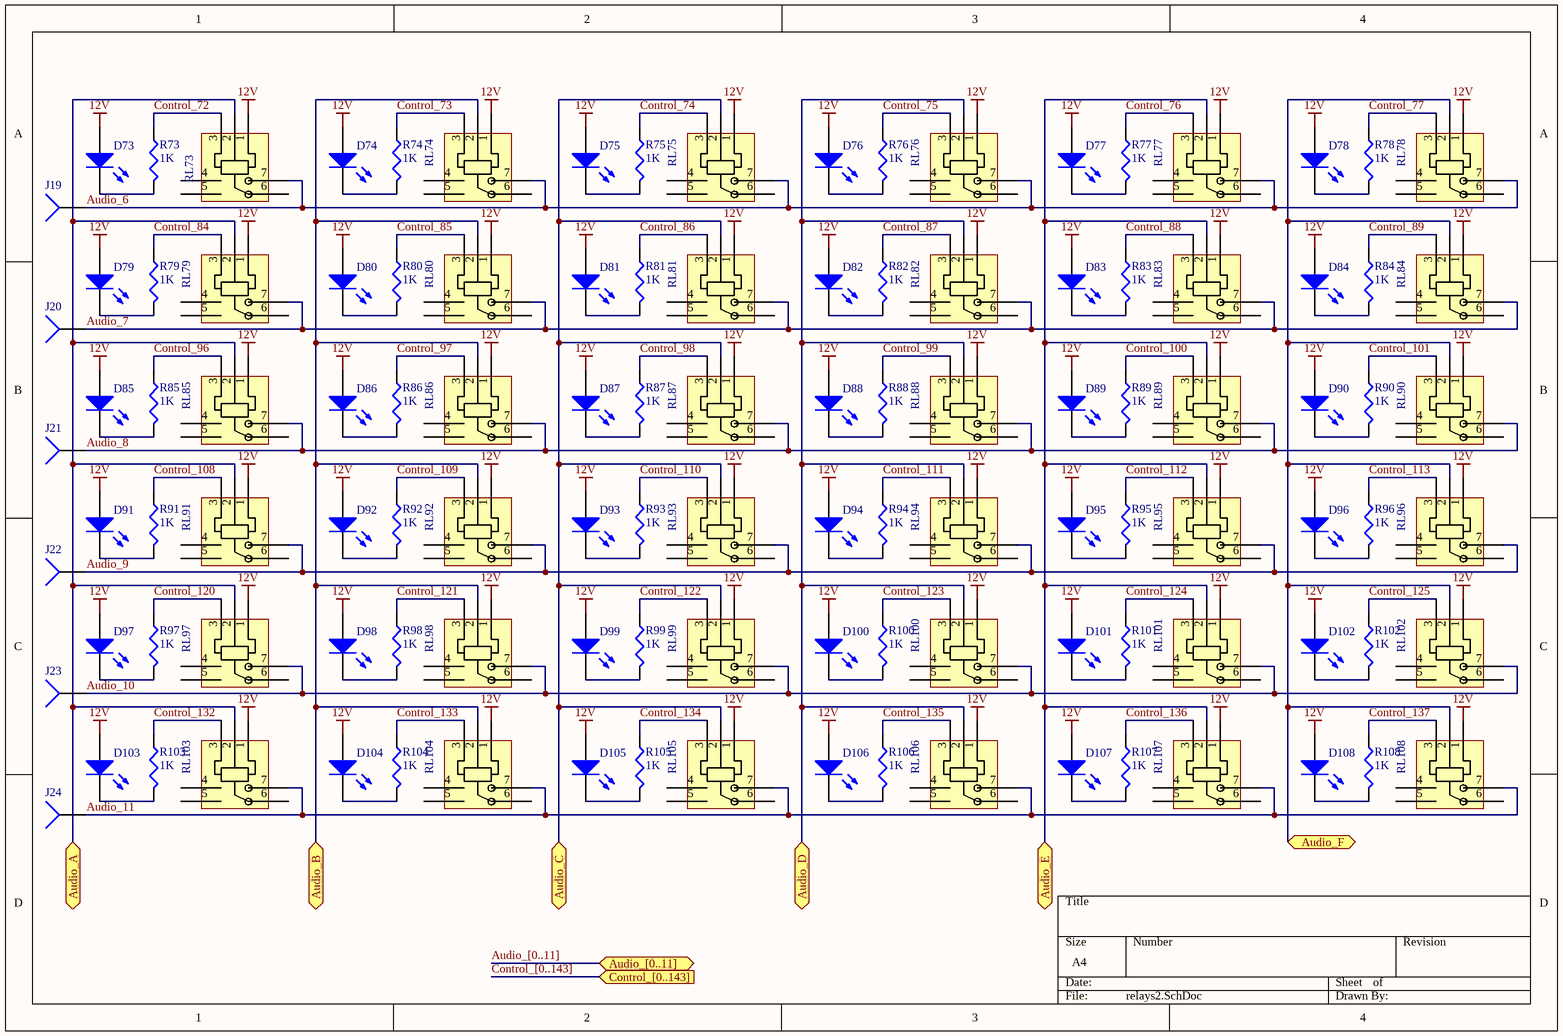
[diagram p3: relays2.SchDoc]

### Parts
D73  LED0  [LED_round_5mm]  (value not drawn)
D74  LED0  [LED_round_5mm]  (value not drawn)
D75  LED0  [LED_round_5mm]  (value not drawn)
D76  LED0  [LED_round_5mm]  (value not drawn)
D77  LED0  [LED_round_5mm]  (value not drawn)
D78  LED0  [LED_round_5mm]  (value not drawn)
D79  LED0  [LED_round_5mm]  (value not drawn)
D80  LED0  [LED_round_5mm]  (value not drawn)
D81  LED0  [LED_round_5mm]  (value not drawn)
D82  LED0  [LED_round_5mm]  (value not drawn)
D83  LED0  [LED_round_5mm]  (value not drawn)
D84  LED0  [LED_round_5mm]  (value not drawn)
D85  LED0  [LED_round_5mm]  (value not drawn)
D86  LED0  [LED_round_5mm]  (value not drawn)
D87  LED0  [LED_round_5mm]  (value not drawn)
D88  LED0  [LED_round_5mm]  (value not drawn)
D89  LED0  [LED_round_5mm]  (value not drawn)
D90  LED0  [LED_round_5mm]  (value not drawn)
D91  LED0  [LED_round_5mm]  (value not drawn)
D92  LED0  [LED_round_5mm]  (value not drawn)
D93  LED0  [LED_round_5mm]  (value not drawn)
D94  LED0  [LED_round_5mm]  (value not drawn)
D95  LED0  [LED_round_5mm]  (value not drawn)
D96  LED0  [LED_round_5mm]  (value not drawn)
D97  LED0  [LED_round_5mm]  (value not drawn)
D98  LED0  [LED_round_5mm]  (value not drawn)
D99  LED0  [LED_round_5mm]  (value not drawn)
D100  LED0  [LED_round_5mm]  (value not drawn)
D101  LED0  [LED_round_5mm]  (value not drawn)
D102  LED0  [LED_round_5mm]  (value not drawn)
D103  LED0  [LED_round_5mm]  (value not drawn)
D104  LED0  [LED_round_5mm]  (value not drawn)
D105  LED0  [LED_round_5mm]  (value not drawn)
D106  LED0  [LED_round_5mm]  (value not drawn)
D107  LED0  [LED_round_5mm]  (value not drawn)
D108  LED0  [LED_round_5mm]  (value not drawn)
J19  Audio  [Conn_1_2x4]  (value not drawn)
J20  Audio  [Conn_1_2x4]  (value not drawn)
J21  Audio  [Conn_1_2x4]  (value not drawn)
J22  Audio  [Conn_1_2x4]  (value not drawn)
J23  Audio  [Conn_1_2x4]  (value not drawn)
J24  Audio  [Conn_1_2x4]  (value not drawn)
R73  value 1K  [J1-0603]  (hidden comment: Res3)
R74  value 1K  [J1-0603]  (hidden comment: Res3)
R75  value 1K  [J1-0603]  (hidden comment: Res3)
R76  value 1K  [J1-0603]  (hidden comment: Res3)
R77  value 1K  [J1-0603]  (hidden comment: Res3)
R78  value 1K  [J1-0603]  (hidden comment: Res3)
R79  value 1K  [J1-0603]  (hidden comment: Res3)
R80  value 1K  [J1-0603]  (hidden comment: Res3)
R81  value 1K  [J1-0603]  (hidden comment: Res3)
R82  value 1K  [J1-0603]  (hidden comment: Res3)
R83  value 1K  [J1-0603]  (hidden comment: Res3)
R84  value 1K  [J1-0603]  (hidden comment: Res3)
R85  value 1K  [J1-0603]  (hidden comment: Res3)
R86  value 1K  [J1-0603]  (hidden comment: Res3)
R87  value 1K  [J1-0603]  (hidden comment: Res3)
R88  value 1K  [J1-0603]  (hidden comment: Res3)
R89  value 1K  [J1-0603]  (hidden comment: Res3)
R90  value 1K  [J1-0603]  (hidden comment: Res3)
R91  value 1K  [J1-0603]  (hidden comment: Res3)
R92  value 1K  [J1-0603]  (hidden comment: Res3)
R93  value 1K  [J1-0603]  (hidden comment: Res3)
R94  value 1K  [J1-0603]  (hidden comment: Res3)
R95  value 1K  [J1-0603]  (hidden comment: Res3)
R96  value 1K  [J1-0603]  (hidden comment: Res3)
R97  value 1K  [J1-0603]  (hidden comment: Res3)
R98  value 1K  [J1-0603]  (hidden comment: Res3)
R99  value 1K  [J1-0603]  (hidden comment: Res3)
R100  value 1K  [J1-0603]  (hidden comment: Res3)
R101  value 1K  [J1-0603]  (hidden comment: Res3)
R102  value 1K  [J1-0603]  (hidden comment: Res3)
R103  value 1K  [J1-0603]  (hidden comment: Res3)
R104  value 1K  [J1-0603]  (hidden comment: Res3)
R105  value 1K  [J1-0603]  (hidden comment: Res3)
R106  value 1K  [J1-0603]  (hidden comment: Res3)
R107  value 1K  [J1-0603]  (hidden comment: Res3)
R108  value 1K  [J1-0603]  (hidden comment: Res3)
RL73  Relay  [Relay_FRA3]  (value not drawn)
RL74  Relay  [Relay_FRA3]  (value not drawn)
RL75  Relay  [Relay_FRA3]  (value not drawn)
RL76  Relay  [Relay_FRA3]  (value not drawn)
RL77  Relay  [Relay_FRA3]  (value not drawn)
RL78  Relay  [Relay_FRA3]  (value not drawn)
RL79  Relay  [Relay_FRA3]  (value not drawn)
RL80  Relay  [Relay_FRA3]  (value not drawn)
RL81  Relay  [Relay_FRA3]  (value not drawn)
RL82  Relay  [Relay_FRA3]  (value not drawn)
RL83  Relay  [Relay_FRA3]  (value not drawn)
RL84  Relay  [Relay_FRA3]  (value not drawn)
RL85  Relay  [Relay_FRA3]  (value not drawn)
RL86  Relay  [Relay_FRA3]  (value not drawn)
RL87  Relay  [Relay_FRA3]  (value not drawn)
RL88  Relay  [Relay_FRA3]  (value not drawn)
RL89  Relay  [Relay_FRA3]  (value not drawn)
RL90  Relay  [Relay_FRA3]  (value not drawn)
RL91  Relay  [Relay_FRA3]  (value not drawn)
RL92  Relay  [Relay_FRA3]  (value not drawn)
RL93  Relay  [Relay_FRA3]  (value not drawn)
RL94  Relay  [Relay_FRA3]  (value not drawn)
RL95  Relay  [Relay_FRA3]  (value not drawn)
RL96  Relay  [Relay_FRA3]  (value not drawn)
RL97  Relay  [Relay_FRA3]  (value not drawn)
RL98  Relay  [Relay_FRA3]  (value not drawn)
RL99  Relay  [Relay_FRA3]  (value not drawn)
RL100  Relay  [Relay_FRA3]  (value not drawn)
RL101  Relay  [Relay_FRA3]  (value not drawn)
RL102  Relay  [Relay_FRA3]  (value not drawn)
RL103  Relay  [Relay_FRA3]  (value not drawn)
RL104  Relay  [Relay_FRA3]  (value not drawn)
RL105  Relay  [Relay_FRA3]  (value not drawn)
RL106  Relay  [Relay_FRA3]  (value not drawn)
RL107  Relay  [Relay_FRA3]  (value not drawn)
RL108  Relay  [Relay_FRA3]  (value not drawn)

### Ports
Audio_[0..11] (bidir), Audio_A (bidir), Audio_B (bidir), Audio_C (bidir), Audio_D (bidir), Audio_E (bidir), Audio_F (bidir), Control_[0..143] (in)

### Nets
12V: D73.1(A) D74.1(A) D75.1(A) D76.1(A) D77.1(A) D78.1(A) D79.1(A) D80.1(A) D81.1(A) D82.1(A) D83.1(A) D84.1(A) D85.1(A) D86.1(A) D87.1(A) D88.1(A) D89.1(A) D90.1(A) D91.1(A) D92.1(A) D93.1(A) D94.1(A) D95.1(A) D96.1(A) D97.1(A) D98.1(A) D99.1(A) D100.1(A) D101.1(A) D102.1(A) D103.1(A) D104.1(A) D105.1(A) D106.1(A) D107.1(A) D108.1(A) RL73.1 RL74.1 RL75.1 RL76.1 RL77.1 RL78.1 RL79.1 RL80.1 RL81.1 RL82.1 RL83.1 RL84.1 RL85.1 RL86.1 RL87.1 RL88.1 RL89.1 RL90.1 RL91.1 RL92.1 RL93.1 RL94.1 RL95.1 RL96.1 RL97.1 RL98.1 RL99.1 RL100.1 RL101.1 RL102.1 RL103.1 RL104.1 RL105.1 RL106.1 RL107.1 RL108.1
Audio_6: J19.1 RL73.7 RL74.7 RL75.7 RL76.7 RL77.7 RL78.7
Audio_7: J20.1 RL79.7 RL80.7 RL81.7 RL82.7 RL83.7 RL84.7
Audio_8: J21.1 RL85.7 RL86.7 RL87.7 RL88.7 RL89.7 RL90.7
Audio_9: J22.1 RL91.7 RL92.7 RL93.7 RL94.7 RL95.7 RL96.7
Audio_10: J23.1 RL97.7 RL98.7 RL99.7 RL100.7 RL101.7 RL102.7
Audio_11: J24.1 RL103.7 RL104.7 RL105.7 RL106.7 RL107.7 RL108.7
Control_72: R73.1 RL73.3
Control_73: R74.1 RL74.3
Control_74: R75.1 RL75.3
Control_75: R76.1 RL76.3
Control_76: R77.1 RL77.3
Control_77: R78.1 RL78.3
Control_84: R79.1 RL79.3
Control_85: R80.1 RL80.3
Control_86: R81.1 RL81.3
Control_87: R82.1 RL82.3
Control_88: R83.1 RL83.3
Control_89: R84.1 RL84.3
Control_96: R85.1 RL85.3
Control_97: R86.1 RL86.3
Control_98: R87.1 RL87.3
Control_99: R88.1 RL88.3
Control_100: R89.1 RL89.3
Control_101: R90.1 RL90.3
Control_108: R91.1 RL91.3
Control_109: R92.1 RL92.3
Control_110: R93.1 RL93.3
Control_111: R94.1 RL94.3
Control_112: R95.1 RL95.3
Control_113: R96.1 RL96.3
Control_120: R97.1 RL97.3
Control_121: R98.1 RL98.3
Control_122: R99.1 RL99.3
Control_123: R100.1 RL100.3
Control_124: R101.1 RL101.3
Control_125: R102.1 RL102.3
Control_132: R103.1 RL103.3
Control_133: R104.1 RL104.3
Control_134: R105.1 RL105.3
Control_135: R106.1 RL106.3
Control_136: R107.1 RL107.3
Control_137: R108.1 RL108.3
NetD73_2: D73.2(K) R73.2
NetD74_2: D74.2(K) R74.2
NetD75_2: D75.2(K) R75.2
NetD76_2: D76.2(K) R76.2
NetD77_2: D77.2(K) R77.2
NetD78_2: D78.2(K) R78.2
NetD79_2: D79.2(K) R79.2
NetD80_2: D80.2(K) R80.2
NetD81_2: D81.2(K) R81.2
NetD82_2: D82.2(K) R82.2
NetD83_2: D83.2(K) R83.2
NetD84_2: D84.2(K) R84.2
NetD85_2: D85.2(K) R85.2
NetD86_2: D86.2(K) R86.2
NetD87_2: D87.2(K) R87.2
NetD88_2: D88.2(K) R88.2
NetD89_2: D89.2(K) R89.2
NetD90_2: D90.2(K) R90.2
NetD91_2: D91.2(K) R91.2
NetD92_2: D92.2(K) R92.2
NetD93_2: D93.2(K) R93.2
NetD94_2: D94.2(K) R94.2
NetD95_2: D95.2(K) R95.2
NetD96_2: D96.2(K) R96.2
NetD97_2: D97.2(K) R97.2
NetD98_2: D98.2(K) R98.2
NetD99_2: D99.2(K) R99.2
NetD100_2: D100.2(K) R100.2
NetD101_2: D101.2(K) R101.2
NetD102_2: D102.2(K) R102.2
NetD103_2: D103.2(K) R103.2
NetD104_2: D104.2(K) R104.2
NetD105_2: D105.2(K) R105.2
NetD106_2: D106.2(K) R106.2
NetD107_2: D107.2(K) R107.2
NetD108_2: D108.2(K) R108.2
NetJ1_1: RL73.2 RL79.2 RL85.2 RL91.2 RL97.2 RL103.2 ; port Audio_A
NetJ2_1: RL74.2 RL80.2 RL86.2 RL92.2 RL98.2 RL104.2 ; port Audio_B
NetJ3_1: RL75.2 RL81.2 RL87.2 RL93.2 RL99.2 RL105.2 ; port Audio_C
NetJ4_1: RL76.2 RL82.2 RL88.2 RL94.2 RL100.2 RL106.2 ; port Audio_D
NetJ5_1: RL77.2 RL83.2 RL89.2 RL95.2 RL101.2 RL107.2 ; port Audio_E
NetJ6_1: RL78.2 RL84.2 RL90.2 RL96.2 RL102.2 RL108.2 ; port Audio_F

Not connected (* = marked no-connect by the designer): RL73 4 5 6; RL74 4 5 6; RL75 4 5 6; RL76 4 5 6; RL77 4 5 6; RL78 4 5 6; RL79 4 5 6; RL80 4 5 6; RL81 4 5 6; RL82 4 5 6; RL83 4 5 6; RL84 4 5 6; RL85 4 5 6; RL86 4 5 6; RL87 4 5 6; RL88 4 5 6; RL89 4 5 6; RL90 4 5 6; RL91 4 5 6; RL92 4 5 6; RL93 4 5 6; RL94 4 5 6; RL95 4 5 6; RL96 4 5 6; RL97 4 5 6; RL98 4 5 6; RL99 4 5 6; RL100 4 5 6; RL101 4 5 6; RL102 4 5 6; RL103 4 5 6; RL104 4 5 6; RL105 4 5 6; RL106 4 5 6; RL107 4 5 6; RL108 4 5 6

### Buses and harness runs
bus Audio_[0..11] = port Audio_[0..11]
bus Control_[0..143] = port Control_[0..143]

### Library data of the parts
D73-D108 = LED0: Typical INFRARED GaAs LED; Published: 8-Jun-2000; LatestRevisionDate: 08-Jul-2005; LatestRevisionNote: Mech Layer 1 removed.; PackageReference: LED-0; Publisher: Altium Limited; PackageDescription: LED; 2 Leads
J19-J24 = Socket: LatestRevisionDate: 17-Jul-2002; LatestRevisionNote: Re-released for DXP Platform.; Publisher: Altium Limited
R73-R108 = Res3: Resistor; Published: 8-Jun-2000; LatestRevisionDate: 29-May-2009; LatestRevisionNote: IPC-7351 Footprint Added.; PackageReference: J1-0603; Publisher: Altium Limited; PackageDescription: Chip Resistor
RL73-RL108 = Relay_FRA3: as RL1 on sheet relays0

## Sheet relays3.SchDoc
size A4
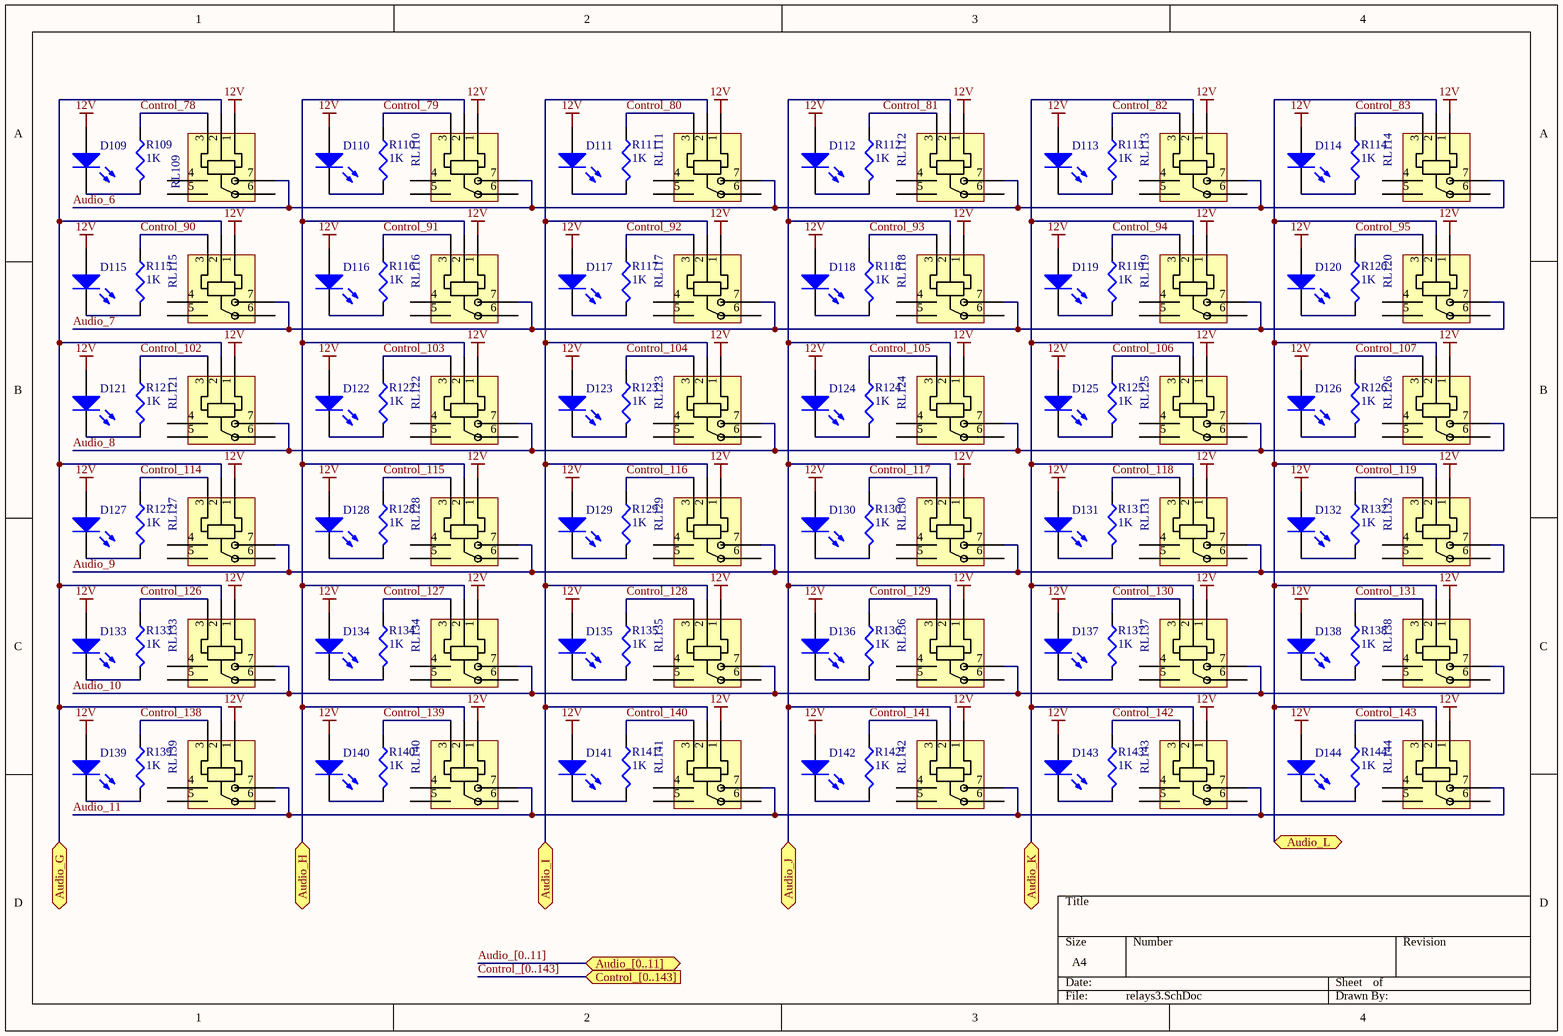
[diagram p4: relays3.SchDoc]

### Parts
D109  LED0  [LED_round_5mm]  (value not drawn)
D110  LED0  [LED_round_5mm]  (value not drawn)
D111  LED0  [LED_round_5mm]  (value not drawn)
D112  LED0  [LED_round_5mm]  (value not drawn)
D113  LED0  [LED_round_5mm]  (value not drawn)
D114  LED0  [LED_round_5mm]  (value not drawn)
D115  LED0  [LED_round_5mm]  (value not drawn)
D116  LED0  [LED_round_5mm]  (value not drawn)
D117  LED0  [LED_round_5mm]  (value not drawn)
D118  LED0  [LED_round_5mm]  (value not drawn)
D119  LED0  [LED_round_5mm]  (value not drawn)
D120  LED0  [LED_round_5mm]  (value not drawn)
D121  LED0  [LED_round_5mm]  (value not drawn)
D122  LED0  [LED_round_5mm]  (value not drawn)
D123  LED0  [LED_round_5mm]  (value not drawn)
D124  LED0  [LED_round_5mm]  (value not drawn)
D125  LED0  [LED_round_5mm]  (value not drawn)
D126  LED0  [LED_round_5mm]  (value not drawn)
D127  LED0  [LED_round_5mm]  (value not drawn)
D128  LED0  [LED_round_5mm]  (value not drawn)
D129  LED0  [LED_round_5mm]  (value not drawn)
D130  LED0  [LED_round_5mm]  (value not drawn)
D131  LED0  [LED_round_5mm]  (value not drawn)
D132  LED0  [LED_round_5mm]  (value not drawn)
D133  LED0  [LED_round_5mm]  (value not drawn)
D134  LED0  [LED_round_5mm]  (value not drawn)
D135  LED0  [LED_round_5mm]  (value not drawn)
D136  LED0  [LED_round_5mm]  (value not drawn)
D137  LED0  [LED_round_5mm]  (value not drawn)
D138  LED0  [LED_round_5mm]  (value not drawn)
D139  LED0  [LED_round_5mm]  (value not drawn)
D140  LED0  [LED_round_5mm]  (value not drawn)
D141  LED0  [LED_round_5mm]  (value not drawn)
D142  LED0  [LED_round_5mm]  (value not drawn)
D143  LED0  [LED_round_5mm]  (value not drawn)
D144  LED0  [LED_round_5mm]  (value not drawn)
R109  value 1K  [J1-0603]  (hidden comment: Res3)
R110  value 1K  [J1-0603]  (hidden comment: Res3)
R111  value 1K  [J1-0603]  (hidden comment: Res3)
R112  value 1K  [J1-0603]  (hidden comment: Res3)
R113  value 1K  [J1-0603]  (hidden comment: Res3)
R114  value 1K  [J1-0603]  (hidden comment: Res3)
R115  value 1K  [J1-0603]  (hidden comment: Res3)
R116  value 1K  [J1-0603]  (hidden comment: Res3)
R117  value 1K  [J1-0603]  (hidden comment: Res3)
R118  value 1K  [J1-0603]  (hidden comment: Res3)
R119  value 1K  [J1-0603]  (hidden comment: Res3)
R120  value 1K  [J1-0603]  (hidden comment: Res3)
R121  value 1K  [J1-0603]  (hidden comment: Res3)
R122  value 1K  [J1-0603]  (hidden comment: Res3)
R123  value 1K  [J1-0603]  (hidden comment: Res3)
R124  value 1K  [J1-0603]  (hidden comment: Res3)
R125  value 1K  [J1-0603]  (hidden comment: Res3)
R126  value 1K  [J1-0603]  (hidden comment: Res3)
R127  value 1K  [J1-0603]  (hidden comment: Res3)
R128  value 1K  [J1-0603]  (hidden comment: Res3)
R129  value 1K  [J1-0603]  (hidden comment: Res3)
R130  value 1K  [J1-0603]  (hidden comment: Res3)
R131  value 1K  [J1-0603]  (hidden comment: Res3)
R132  value 1K  [J1-0603]  (hidden comment: Res3)
R133  value 1K  [J1-0603]  (hidden comment: Res3)
R134  value 1K  [J1-0603]  (hidden comment: Res3)
R135  value 1K  [J1-0603]  (hidden comment: Res3)
R136  value 1K  [J1-0603]  (hidden comment: Res3)
R137  value 1K  [J1-0603]  (hidden comment: Res3)
R138  value 1K  [J1-0603]  (hidden comment: Res3)
R139  value 1K  [J1-0603]  (hidden comment: Res3)
R140  value 1K  [J1-0603]  (hidden comment: Res3)
R141  value 1K  [J1-0603]  (hidden comment: Res3)
R142  value 1K  [J1-0603]  (hidden comment: Res3)
R143  value 1K  [J1-0603]  (hidden comment: Res3)
R144  value 1K  [J1-0603]  (hidden comment: Res3)
RL109  Relay  [Relay_FRA3]  (value not drawn)
RL110  Relay  [Relay_FRA3]  (value not drawn)
RL111  Relay  [Relay_FRA3]  (value not drawn)
RL112  Relay  [Relay_FRA3]  (value not drawn)
RL113  Relay  [Relay_FRA3]  (value not drawn)
RL114  Relay  [Relay_FRA3]  (value not drawn)
RL115  Relay  [Relay_FRA3]  (value not drawn)
RL116  Relay  [Relay_FRA3]  (value not drawn)
RL117  Relay  [Relay_FRA3]  (value not drawn)
RL118  Relay  [Relay_FRA3]  (value not drawn)
RL119  Relay  [Relay_FRA3]  (value not drawn)
RL120  Relay  [Relay_FRA3]  (value not drawn)
RL121  Relay  [Relay_FRA3]  (value not drawn)
RL122  Relay  [Relay_FRA3]  (value not drawn)
RL123  Relay  [Relay_FRA3]  (value not drawn)
RL124  Relay  [Relay_FRA3]  (value not drawn)
RL125  Relay  [Relay_FRA3]  (value not drawn)
RL126  Relay  [Relay_FRA3]  (value not drawn)
RL127  Relay  [Relay_FRA3]  (value not drawn)
RL128  Relay  [Relay_FRA3]  (value not drawn)
RL129  Relay  [Relay_FRA3]  (value not drawn)
RL130  Relay  [Relay_FRA3]  (value not drawn)
RL131  Relay  [Relay_FRA3]  (value not drawn)
RL132  Relay  [Relay_FRA3]  (value not drawn)
RL133  Relay  [Relay_FRA3]  (value not drawn)
RL134  Relay  [Relay_FRA3]  (value not drawn)
RL135  Relay  [Relay_FRA3]  (value not drawn)
RL136  Relay  [Relay_FRA3]  (value not drawn)
RL137  Relay  [Relay_FRA3]  (value not drawn)
RL138  Relay  [Relay_FRA3]  (value not drawn)
RL139  Relay  [Relay_FRA3]  (value not drawn)
RL140  Relay  [Relay_FRA3]  (value not drawn)
RL141  Relay  [Relay_FRA3]  (value not drawn)
RL142  Relay  [Relay_FRA3]  (value not drawn)
RL143  Relay  [Relay_FRA3]  (value not drawn)
RL144  Relay  [Relay_FRA3]  (value not drawn)

### Ports
Audio_[0..11] (bidir), Audio_G (bidir), Audio_H (bidir), Audio_I (bidir), Audio_J (bidir), Audio_K (bidir), Audio_L (bidir), Control_[0..143] (in)

### Nets
12V: D109.1(A) D110.1(A) D111.1(A) D112.1(A) D113.1(A) D114.1(A) D115.1(A) D116.1(A) D117.1(A) D118.1(A) D119.1(A) D120.1(A) D121.1(A) D122.1(A) D123.1(A) D124.1(A) D125.1(A) D126.1(A) D127.1(A) D128.1(A) D129.1(A) D130.1(A) D131.1(A) D132.1(A) D133.1(A) D134.1(A) D135.1(A) D136.1(A) D137.1(A) D138.1(A) D139.1(A) D140.1(A) D141.1(A) D142.1(A) D143.1(A) D144.1(A) RL109.1 RL110.1 RL111.1 RL112.1 RL113.1 RL114.1 RL115.1 RL116.1 RL117.1 RL118.1 RL119.1 RL120.1 RL121.1 RL122.1 RL123.1 RL124.1 RL125.1 RL126.1 RL127.1 RL128.1 RL129.1 RL130.1 RL131.1 RL132.1 RL133.1 RL134.1 RL135.1 RL136.1 RL137.1 RL138.1 RL139.1 RL140.1 RL141.1 RL142.1 RL143.1 RL144.1
Audio_6: RL109.7 RL110.7 RL111.7 RL112.7 RL113.7 RL114.7
Audio_7: RL115.7 RL116.7 RL117.7 RL118.7 RL119.7 RL120.7
Audio_8: RL121.7 RL122.7 RL123.7 RL124.7 RL125.7 RL126.7
Audio_9: RL127.7 RL128.7 RL129.7 RL130.7 RL131.7 RL132.7
Audio_10: RL133.7 RL134.7 RL135.7 RL136.7 RL137.7 RL138.7
Audio_11: RL139.7 RL140.7 RL141.7 RL142.7 RL143.7 RL144.7
Control_78: R109.1 RL109.3
Control_79: R110.1 RL110.3
Control_80: R111.1 RL111.3
Control_81: R112.1 RL112.3
Control_82: R113.1 RL113.3
Control_83: R114.1 RL114.3
Control_90: R115.1 RL115.3
Control_91: R116.1 RL116.3
Control_92: R117.1 RL117.3
Control_93: R118.1 RL118.3
Control_94: R119.1 RL119.3
Control_95: R120.1 RL120.3
Control_102: R121.1 RL121.3
Control_103: R122.1 RL122.3
Control_104: R123.1 RL123.3
Control_105: R124.1 RL124.3
Control_106: R125.1 RL125.3
Control_107: R126.1 RL126.3
Control_114: R127.1 RL127.3
Control_115: R128.1 RL128.3
Control_116: R129.1 RL129.3
Control_117: R130.1 RL130.3
Control_118: R131.1 RL131.3
Control_119: R132.1 RL132.3
Control_126: R133.1 RL133.3
Control_127: R134.1 RL134.3
Control_128: R135.1 RL135.3
Control_129: R136.1 RL136.3
Control_130: R137.1 RL137.3
Control_131: R138.1 RL138.3
Control_138: R139.1 RL139.3
Control_139: R140.1 RL140.3
Control_140: R141.1 RL141.3
Control_141: R142.1 RL142.3
Control_142: R143.1 RL143.3
Control_143: R144.1 RL144.3
NetD109_2: D109.2(K) R109.2
NetD110_2: D110.2(K) R110.2
NetD111_2: D111.2(K) R111.2
NetD112_2: D112.2(K) R112.2
NetD113_2: D113.2(K) R113.2
NetD114_2: D114.2(K) R114.2
NetD115_2: D115.2(K) R115.2
NetD116_2: D116.2(K) R116.2
NetD117_2: D117.2(K) R117.2
NetD118_2: D118.2(K) R118.2
NetD119_2: D119.2(K) R119.2
NetD120_2: D120.2(K) R120.2
NetD121_2: D121.2(K) R121.2
NetD122_2: D122.2(K) R122.2
NetD123_2: D123.2(K) R123.2
NetD124_2: D124.2(K) R124.2
NetD125_2: D125.2(K) R125.2
NetD126_2: D126.2(K) R126.2
NetD127_2: D127.2(K) R127.2
NetD128_2: D128.2(K) R128.2
NetD129_2: D129.2(K) R129.2
NetD130_2: D130.2(K) R130.2
NetD131_2: D131.2(K) R131.2
NetD132_2: D132.2(K) R132.2
NetD133_2: D133.2(K) R133.2
NetD134_2: D134.2(K) R134.2
NetD135_2: D135.2(K) R135.2
NetD136_2: D136.2(K) R136.2
NetD137_2: D137.2(K) R137.2
NetD138_2: D138.2(K) R138.2
NetD139_2: D139.2(K) R139.2
NetD140_2: D140.2(K) R140.2
NetD141_2: D141.2(K) R141.2
NetD142_2: D142.2(K) R142.2
NetD143_2: D143.2(K) R143.2
NetD144_2: D144.2(K) R144.2
NetJ13_1: RL109.2 RL115.2 RL121.2 RL127.2 RL133.2 RL139.2 ; port Audio_G
NetJ14_1: RL110.2 RL116.2 RL122.2 RL128.2 RL134.2 RL140.2 ; port Audio_H
NetJ15_1: RL111.2 RL117.2 RL123.2 RL129.2 RL135.2 RL141.2 ; port Audio_I
NetJ16_1: RL112.2 RL118.2 RL124.2 RL130.2 RL136.2 RL142.2 ; port Audio_J
NetJ17_1: RL113.2 RL119.2 RL125.2 RL131.2 RL137.2 RL143.2 ; port Audio_K
NetJ18_1: RL114.2 RL120.2 RL126.2 RL132.2 RL138.2 RL144.2 ; port Audio_L

Not connected (* = marked no-connect by the designer): RL109 4 5 6; RL110 4 5 6; RL111 4 5 6; RL112 4 5 6; RL113 4 5 6; RL114 4 5 6; RL115 4 5 6; RL116 4 5 6; RL117 4 5 6; RL118 4 5 6; RL119 4 5 6; RL120 4 5 6; RL121 4 5 6; RL122 4 5 6; RL123 4 5 6; RL124 4 5 6; RL125 4 5 6; RL126 4 5 6; RL127 4 5 6; RL128 4 5 6; RL129 4 5 6; RL130 4 5 6; RL131 4 5 6; RL132 4 5 6; RL133 4 5 6; RL134 4 5 6; RL135 4 5 6; RL136 4 5 6; RL137 4 5 6; RL138 4 5 6; RL139 4 5 6; RL140 4 5 6; RL141 4 5 6; RL142 4 5 6; RL143 4 5 6; RL144 4 5 6

### Buses and harness runs
bus Audio_[0..11] = port Audio_[0..11]
bus Control_[0..143] = port Control_[0..143]

### Library data of the parts
D109-D144 = LED0: Typical INFRARED GaAs LED; Published: 8-Jun-2000; LatestRevisionDate: 08-Jul-2005; LatestRevisionNote: Mech Layer 1 removed.; PackageReference: LED-0; Publisher: Altium Limited; PackageDescription: LED; 2 Leads
R109-R144 = Res3: Resistor; Published: 8-Jun-2000; LatestRevisionDate: 29-May-2009; LatestRevisionNote: IPC-7351 Footprint Added.; PackageReference: J1-0603; Publisher: Altium Limited; PackageDescription: Chip Resistor
RL109-RL144 = Relay_FRA3: as RL1 on sheet relays0